# EAGLE schematic RAM Board (EAGLE 6.4)
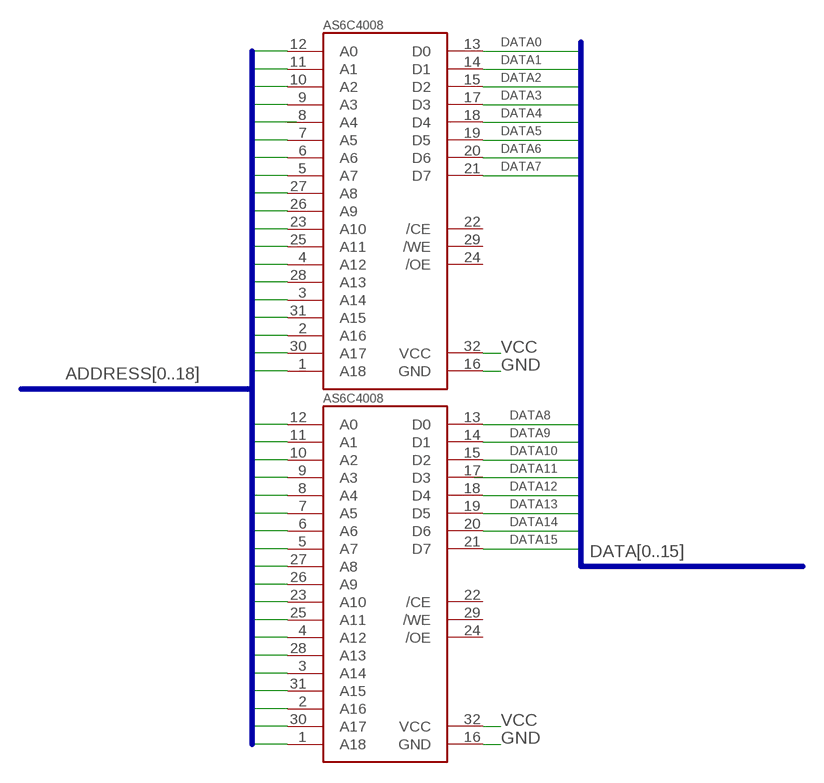
[diagram p0: schematic, sheet 1]

## Parts
U$1  AS6C4008  [DIL32]
U$2  AS6C4008  [DIL32]

## Nets
ADDRESS0: U$1.12(A0) U$2.12(A0)
ADDRESS1: U$1.11(A1) U$2.11(A1)
ADDRESS2: U$1.10(A2) U$2.10(A2)
ADDRESS3: U$1.9(A3) U$2.9(A3)
ADDRESS4: U$2.8(A4)
ADDRESS5: U$1.7(A5) U$2.7(A5)
ADDRESS6: U$1.6(A6) U$2.6(A6)
ADDRESS7: U$1.5(A7) U$2.5(A7)
ADDRESS8: U$1.27(A8) U$2.27(A8)
ADDRESS9: U$1.26(A9) U$2.26(A9)
ADDRESS10: U$1.23(A10) U$2.23(A10)
ADDRESS11: U$1.25(A11) U$2.25(A11)
ADDRESS12: U$1.4(A12) U$2.4(A12)
ADDRESS13: U$1.28(A13) U$2.28(A13)
ADDRESS14: U$1.3(A14) U$2.3(A14)
ADDRESS15: U$1.31(A15) U$2.31(A15)
ADDRESS16: U$1.2(A16) U$2.2(A16)
ADDRESS17: U$1.30(A17) U$2.30(A17)
ADDRESS18: U$1.1(A18) U$2.1(A18)
DATA0: U$1.13(D0)
DATA1: U$1.14(D1)
DATA2: U$1.15(D2)
DATA3: U$1.17(D3)
DATA4: U$1.18(D4)
DATA5: U$1.19(D5)
DATA6: U$1.20(D6)
DATA7: U$1.21(D7)
DATA8: U$2.13(D0)
DATA9: U$2.14(D1)
DATA10: U$2.15(D2)
DATA12: U$2.18(D4)
DATA13: U$2.19(D5)
DATA14: U$2.20(D6)
DATA15: U$2.21(D7)
GND: U$1.16(GND) U$2.16(GND)
VCC: U$1.32(VCC) U$2.32(VCC)
Unconnected: U$1.8(A4) U$1.22(/CE) U$1.24(/OE) U$1.29(/WE) U$2.17(D3) U$2.22(/CE) U$2.24(/OE) U$2.29(/WE)

## Buses
ADDRESS[0..18]
DATA[0..15]

## Library data of the parts
U$1 U$2 = Benchoff:AS6C4008